# Altium schematic sheet Esquemático.SchDoc
size A2
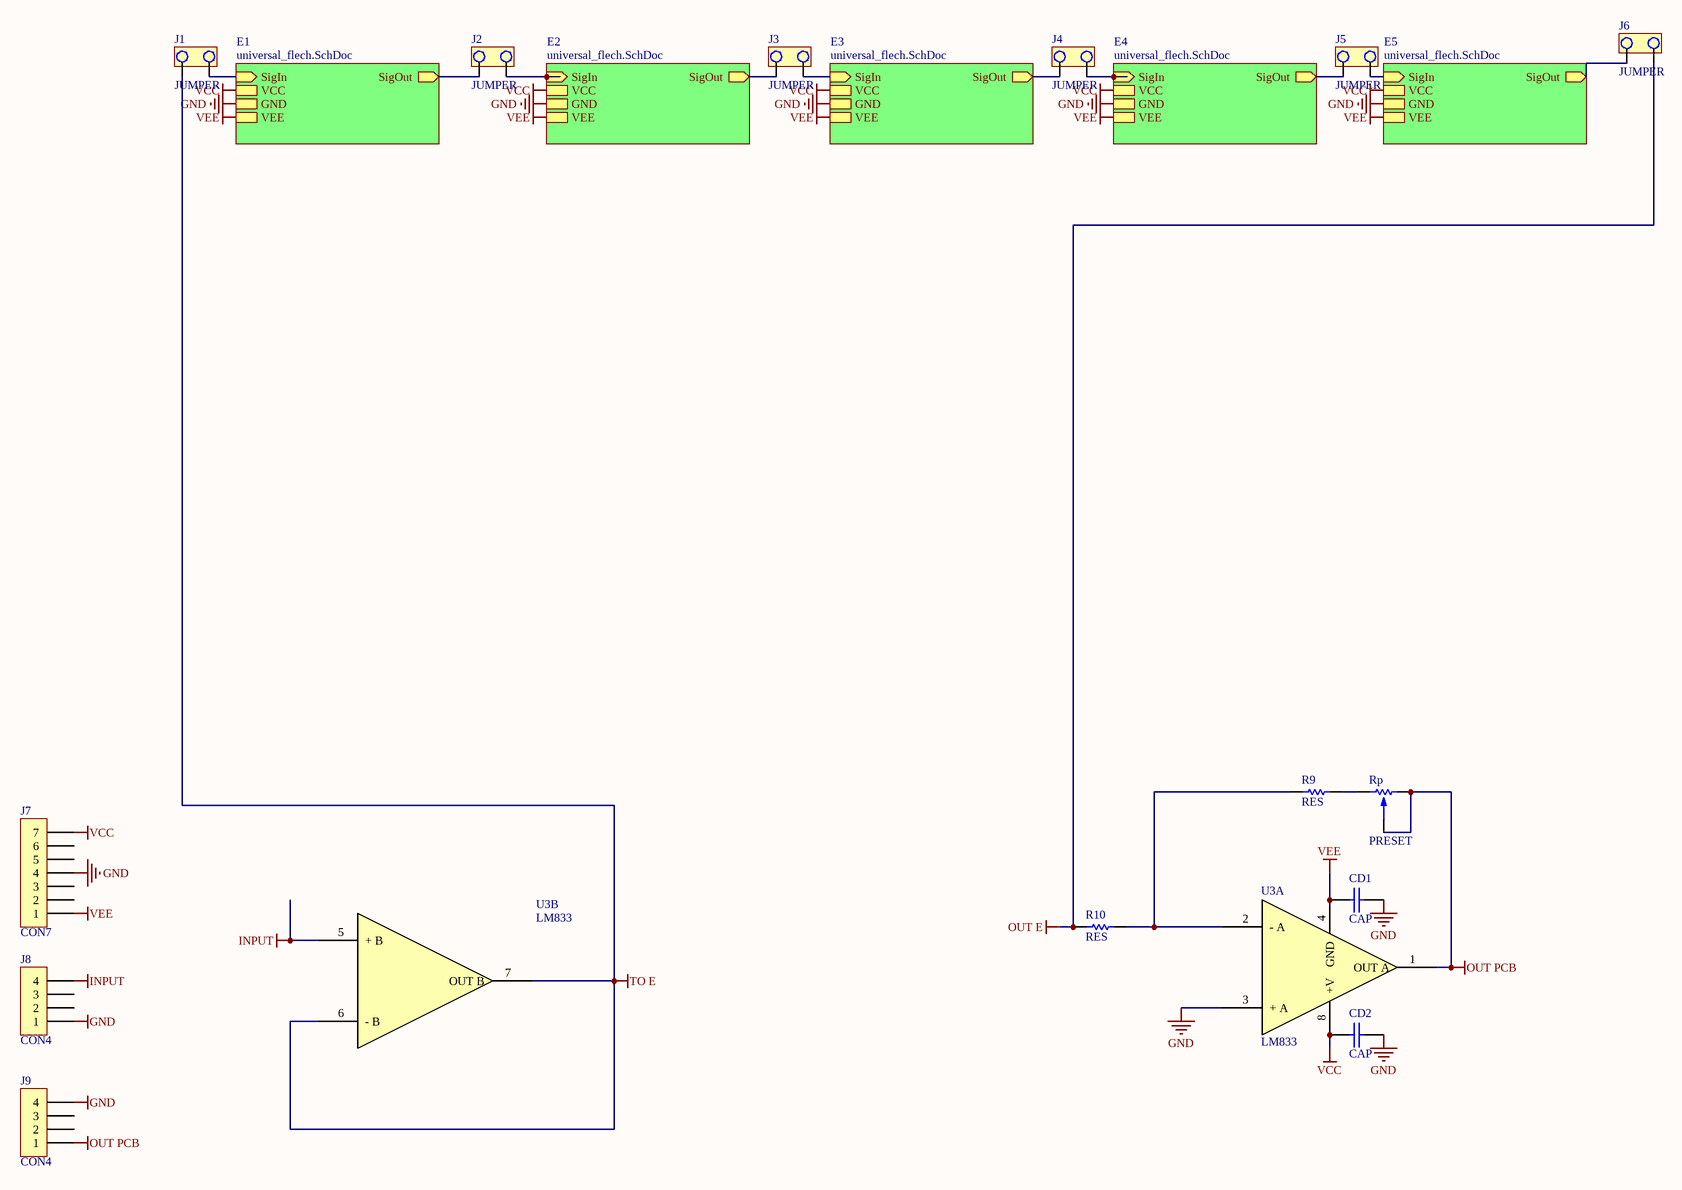
[diagram p0: Esquemático.SchDoc]

## Parts
CD1  CAP  [CAP200]
CD2  CAP  [CAP200]
J1  JUMPER  [JUMPER2]
J2  JUMPER  [JUMPER2]
J3  JUMPER  [JUMPER2]
J4  JUMPER  [JUMPER2]
J5  JUMPER  [JUMPER2]
J6  JUMPER  [JUMPER2]
J7  CON7  [SIP7]
J8  CON4  [SIP4]
J9  CON4  [SIP4]
R9  RES  [0805]
R10  RES  [0805]
Rp  PRESET  [PRESET V]
U3  LM833  [DIP8]  (parts A,B of 2)

## Sub-sheets
E1 = universal_flech.SchDoc: SigIn (in), SigOut (out), VCC, GND, VEE
E2 = universal_flech.SchDoc: SigIn (in), SigOut (out), VCC, GND, VEE
E3 = universal_flech.SchDoc: SigIn (in), SigOut (out), VCC, GND, VEE
E4 = universal_flech.SchDoc: SigIn (in), SigOut (out), VCC, GND, VEE
E5 = universal_flech.SchDoc: SigIn (in), SigOut (out), VCC, GND, VEE

## Nets
GND: CD1.2 CD2.2 J7.4 J8.1 J9.4 U3.3(+_A) ; sheet E1/GND, sheet E2/GND, sheet E3/GND, sheet E4/GND, sheet E5/GND
INPUT: J8.4 U3.5(+_B)
OUT E: J6.1 R10.1
OUT PCB: J9.1 Rp.1 Rp.2 U3.1(OUT_A)
TO E: J1.2 U3.6(-_B) U3.7(OUT_B)
VCC: CD2.1 J7.7 U3.8(+V) ; sheet E1/VCC, sheet E2/VCC, sheet E3/VCC, sheet E4/VCC, sheet E5/VCC
VEE: CD1.1 J7.1 U3.4(GND) ; sheet E1/VEE, sheet E2/VEE, sheet E3/VEE, sheet E4/VEE, sheet E5/VEE
NetJ1_1: J1.1 ; sheet E1/SigIn
NetJ2_1: J2.1 ; sheet E2/SigIn
NetJ2_2: J2.2 ; sheet E1/SigOut
NetJ3_1: J3.1 ; sheet E3/SigIn
NetJ3_2: J3.2 ; sheet E2/SigOut
NetJ4_1: J4.1 ; sheet E4/SigIn
NetJ4_2: J4.2 ; sheet E3/SigOut
NetJ5_1: J5.1 ; sheet E5/SigIn
NetJ5_2: J5.2 ; sheet E4/SigOut
NetJ6_2: J6.2 ; sheet E5/SigOut
NetR9_1: R9.1 R10.2 U3.2(-_A)
NetR9_2: R9.2 Rp.3

Not connected (* = marked no-connect by the designer): J7 2 3 5 6; J8 2 3; J9 2 3

## Library data of the parts
U3 = LM833: Dual Audio Operational Amplifier